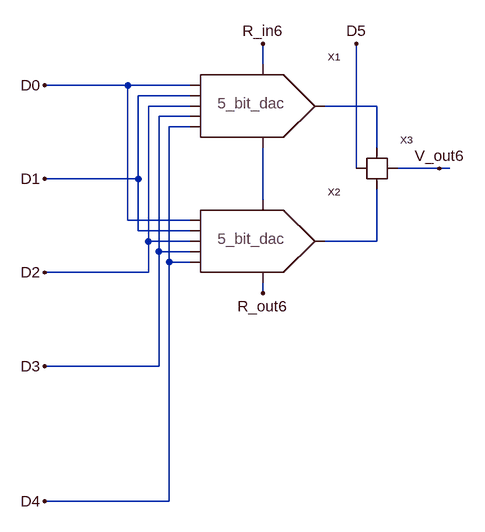
[diagram p0: schematic 6_bit_dac.asc]
6_bit_dac.asc, the LTspice schematic file:
Version 4
SHEET 1 880 836
WIRE 240 64 240 32
WIRE 32 96 -96 96
WIRE 128 96 32 96
WIRE 128 112 48 112
WIRE 128 128 64 128
WIRE 416 128 336 128
WIRE 128 144 80 144
WIRE 128 160 96 160
WIRE 416 192 416 128
WIRE 384 224 384 32
WIRE 512 224 448 224
WIRE 528 224 512 224
WIRE 48 240 48 112
WIRE 48 240 -96 240
WIRE 240 272 240 192
WIRE 32 304 32 96
WIRE 128 304 32 304
WIRE 48 320 48 240
WIRE 128 320 48 320
WIRE 64 336 64 128
WIRE 128 336 64 336
WIRE 416 336 416 256
WIRE 416 336 336 336
WIRE 80 352 80 144
WIRE 128 352 80 352
WIRE 96 368 96 160
WIRE 128 368 96 368
WIRE 64 384 64 336
WIRE 64 384 -96 384
WIRE 240 416 240 400
WIRE 80 528 80 352
WIRE 80 528 -96 528
WIRE 96 736 96 368
WIRE 96 736 -96 736
FLAG 512 224 V_out6
FLAG -96 96 D0
FLAG -96 240 D1
FLAG -96 384 D2
FLAG -96 528 D3
FLAG -96 736 D4
FLAG 240 32 R_in6
FLAG 384 32 D5
FLAG 240 416 R_out6
SYMBOL 5_bit_dac 192 128 R0
SYMATTR InstName X1
SYMBOL 5_bit_dac 192 336 R0
SYMATTR InstName X2
SYMBOL switch 416 224 R0
SYMATTR InstName X3

The netlist it stands for:
* 6_bit_dac.asc
XX1 D0 D1 D2 D3 D4 R_in6 N002 N001 5_bit_dac  ; pins D0 D1 D2 D3 D4 R_in5 R_out5 V_out5
XX2 D0 D1 D2 D3 D4 N002 R_out6 N003 5_bit_dac  ; pins D0 D1 D2 D3 D4 R_in5 R_out5 V_out5
XX3 D5 N001 N003 V_out6 switch  ; pins digital_input Vin_1 Vin_2 Vout
.backanno
.end